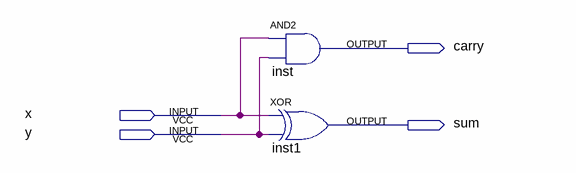
[diagram p0: schematic sheet]
// Quartus schematic half_adder_sch.bdf as structural Verilog: 2 symbols, 4 pins
module half_adder_sch (
  input  x,
  input  y,
  output carry,
  output sum
);

  and inst (carry, x, y);
  xor inst1 (sum, x, y);
endmodule
